# Altium schematic sheet Varistor 10D561K.schdoc
size 127 x 99 mm
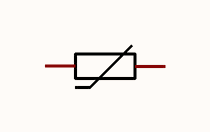
[diagram p0: Varistor 10D561K.schdoc]

## Parts
R?  10D561K_C233178  [RES-TH_L12.5-W7.0-P7.50-D1.2-S7.00]  (value not drawn)

## Nets

Not connected (* = marked no-connect by the designer): R? 1 2

## Library data of the parts
R? = 10D561K_C233178: Manufacturer: RUILON(瑞隆源); Value: Shenzhen; Add into BOM: yes; Varistor Voltage: 504V~616V; Maximum Energy: 42.3J; Typical Capatitance: 180pF@1kHz; Symbol: 10D561K_C233178; Device: 10D561K_C233178; Supplier: LCSC; Supplier Part: C233178; Manufacturer Part: 10D561K; JLCPCB Part Class: Extended Part; LCSC Part Name: 钳位电压920V 42.3焦耳 插件压敏电阻; Supplier Footprint: 插件; Datasheet: https://atta.szlcsc.com/upload/public/pdf/source/20180619/C233186_9A7AF57C0A178A4DEED9AC3F9621CA64.pdf; Convert to PCB: yes